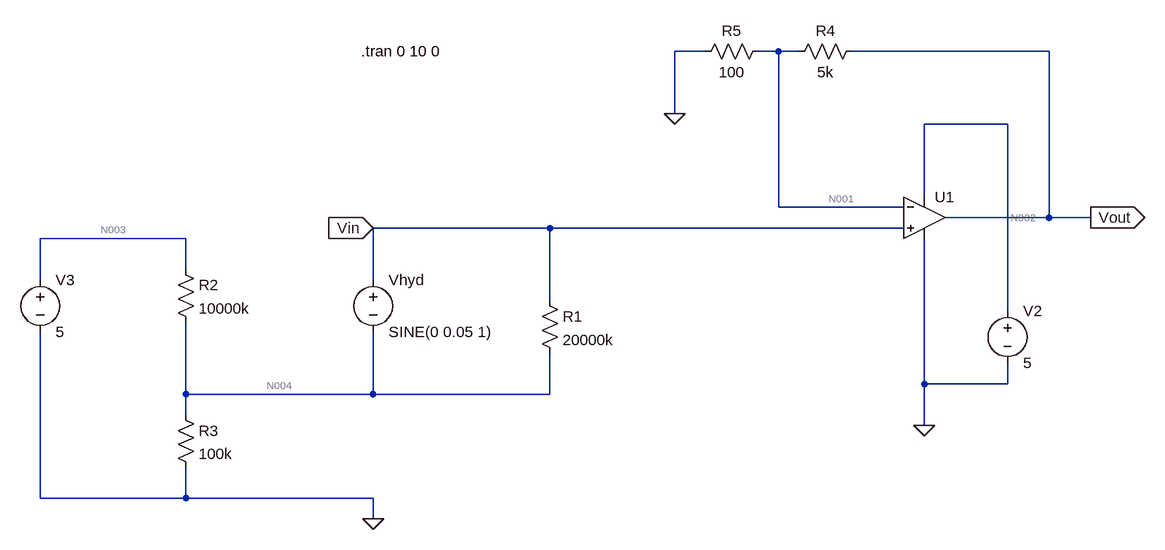
[diagram p0: schematic preamp1.asc]
preamp1.asc, the LTspice schematic file:
Version 4
SHEET 1 1820 680
WIRE 608 -240 560 -240
WIRE 720 -240 688 -240
WIRE 752 -240 720 -240
WIRE 1136 -240 832 -240
WIRE 560 -144 560 -240
WIRE 1072 -128 944 -128
WIRE 944 -16 944 -128
WIRE 720 0 720 -240
WIRE 912 0 720 0
WIRE 1136 16 1136 -240
WIRE 1136 16 976 16
WIRE 1200 16 1136 16
WIRE 368 32 96 32
WIRE 912 32 368 32
WIRE -192 48 -416 48
WIRE -192 96 -192 48
WIRE -416 112 -416 48
WIRE 96 112 96 32
WIRE 368 144 368 32
WIRE 1072 160 1072 -128
WIRE 944 272 944 48
WIRE 1072 272 1072 240
WIRE 1072 272 944 272
WIRE -192 288 -192 176
WIRE 96 288 96 192
WIRE 96 288 -192 288
WIRE 368 288 368 224
WIRE 368 288 96 288
WIRE -192 320 -192 288
WIRE 944 336 944 272
WIRE -416 448 -416 192
WIRE -192 448 -192 400
WIRE -192 448 -416 448
WIRE 96 448 -192 448
WIRE 96 480 96 448
FLAG 944 336 0
FLAG 560 -144 0
FLAG 1200 16 Vout
IOPIN 1200 16 Out
FLAG 96 32 Vin
IOPIN 96 32 In
FLAG 96 480 0
SYMBOL res 848 -256 R90
WINDOW 0 0 56 VBottom 2
WINDOW 3 32 56 VTop 2
SYMATTR InstName R4
SYMATTR Value 5k
SYMBOL res 704 -256 R90
WINDOW 0 0 56 VBottom 2
WINDOW 3 32 56 VTop 2
SYMATTR InstName R5
SYMATTR Value 100
SYMBOL voltage 1072 144 R0
SYMATTR InstName V2
SYMATTR Value 5
SYMBOL voltage 96 96 R0
WINDOW 123 0 0 Left 2
WINDOW 39 0 0 Left 2
SYMATTR InstName Vhyd
SYMATTR Value SINE(0 0.05 1)
SYMBOL Opamps\\UniversalOpamp2 944 16 R0
SYMATTR InstName U1
SYMBOL res 352 128 R0
SYMATTR InstName R1
SYMATTR Value 20000k
SYMBOL voltage -416 96 R0
WINDOW 123 0 0 Left 2
WINDOW 39 0 0 Left 2
SYMATTR InstName V3
SYMATTR Value 5
SYMBOL res -208 80 R0
SYMATTR InstName R2
SYMATTR Value 10000k
SYMBOL res -208 304 R0
SYMATTR InstName R3
SYMATTR Value 100k
TEXT 78 -240 Left 2 !.tran 0 10 0

The netlist it stands for:
* preamp1.asc
R4 Vout N001 5k
R5 N001 0 100
V2 N002 0 5
Vhyd Vin N004 SINE(0 0.05 1)
XU1 Vin N001 N002 0 Vout level.2 Avol=1Meg GBW=10Meg Slew=10Meg ilimit=25m rail=0 Vos=0 phimargin=45 en=0 enk=0 in=0 ink=0 Rin=500Meg  ; pins IN+ IN- V+ V- OUT
R1 Vin N004 20000k
V3 N003 0 5
R2 N003 N004 10000k
R3 N004 0 100k
.tran 0 10 0
.lib UniversalOpamps2.sub
.backanno
.end

* Results of the author's LTspice run, read from the files saved beside the schematic
* Operating Point, zero values left out:
*   V(vout) = 2.549 V
*   V(n001) = 49.99 mV
*   V(n002) = 5 V
*   V(vin) = 49.99 mV
*   V(n004) = 49.99 mV
*   V(n003) = 5 V
*   I(R3) = 499.9 nA
*   I(R2) = 495 nA
*   I(R5) = 499.9 µA
*   I(R4) = 499.9 µA
*   I(V3) = -495 nA
*   I(Vhyd) = 4.9 nA
*   I(V2) = -603.4 µA
*   Ix(u1:1) = -4.9 nA
*   Ix(u1:2) = -4.9 nA
*   Ix(u1:3) = 603.4 µA
*   Ix(u1:4) = -103.5 µA
*   Ix(u1:5) = -499.9 µA
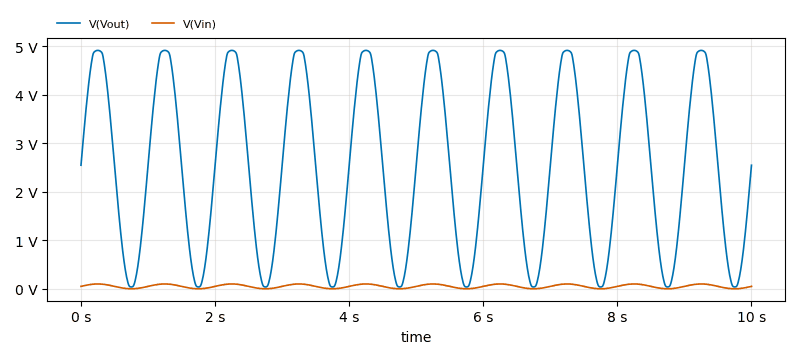
[diagram p1: Transient Analysis of preamp1.asc, plotted from the saved traces]
* Transient Analysis, 1 run:
*   V(Vout): min 37.66 mV, max 4.919 V, average 2.534 V, rms 3.096 V, last 2.549 V
*   V(Vin): min 47.67 µV, max 99.93 mV, average 49.98 mV, rms 61.22 mV, last 49.99 mV